# Altium schematic sheet Precharge.SchDoc
size A4; SheetNumber: 5; SheetTotal: 6
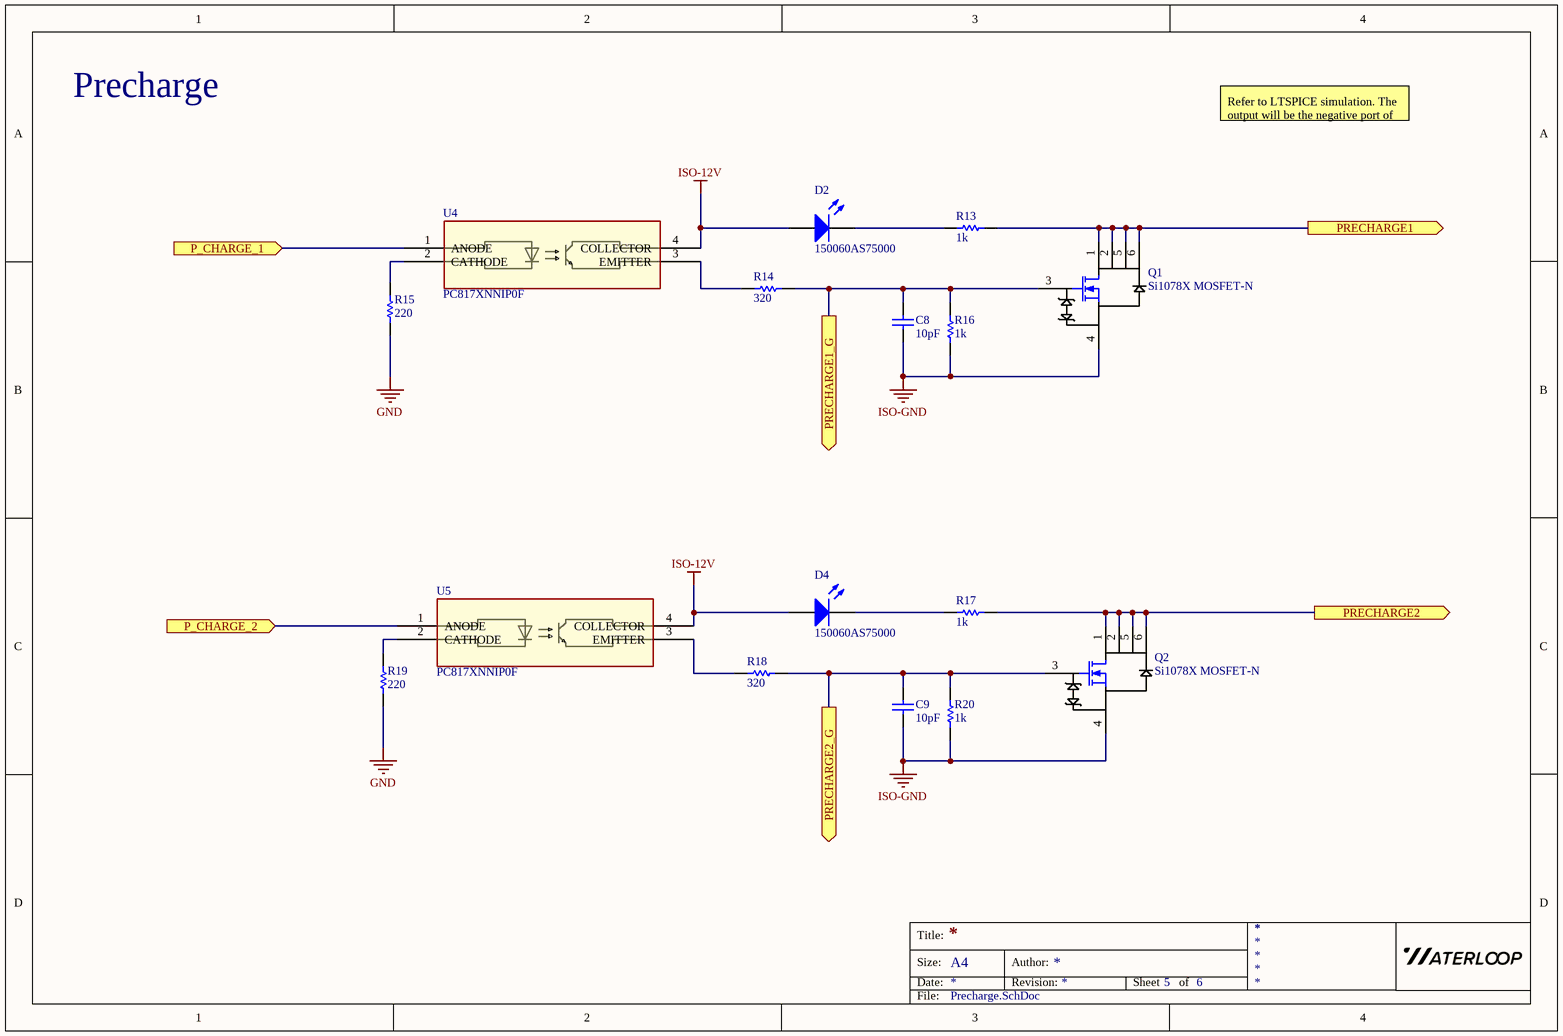
[diagram p0: Precharge.SchDoc]

## Parts
C8  value 10pF  [0603 - Capacitor]  (hidden comment: Capacitor - Nonpolarized)
C9  value 10pF  [0603 - Capacitor]  (hidden comment: Capacitor - Nonpolarized)
D2  150060AS75000  [0603 - Resistor]
D4  150060AS75000  [0603 - Resistor]
Q1  Si1078X MOSFET-N  [Si1078X NMOS 30V]
Q2  Si1078X MOSFET-N  [Si1078X NMOS 30V]
R13  value 1k  [0603 - Resistor]  (hidden comment: Resistor)
R14  value 320  [0603 - Resistor]  (hidden comment: Resistor)
R15  value 220  [0603 - Resistor]  (hidden comment: Resistor)
R16  value 1k  [0603 - Resistor]  (hidden comment: Resistor)
R17  value 1k  [0603 - Resistor]  (hidden comment: Resistor)
R18  value 320  [0603 - Resistor]  (hidden comment: Resistor)
R19  value 220  [0603 - Resistor]  (hidden comment: Resistor)
R20  value 1k  [0603 - Resistor]  (hidden comment: Resistor)
U4  PC817XNNIP0F  [PC817XNNIP0F_SHP]
U5  PC817XNNIP0F  [PC817XNNIP0F_SHP]

## Ports
P_CHARGE_1 (in), P_CHARGE_2 (in), PRECHARGE1 (out), PRECHARGE1_G (out), PRECHARGE2 (out), PRECHARGE2_G (out)

## Nets
GND: R15.1 R19.1
ISO-12V: D2.1(A) D4.1(A) U4.4(COLLECTOR) U5.4(COLLECTOR)
ISO-GND: C8.1 C9.1 Q1.4 Q2.4 R16.1 R20.1
P_CHARGE_1: U4.1(ANODE) ; port P_CHARGE_1
P_CHARGE_2: U5.1(ANODE) ; port P_CHARGE_2
PRECHARGE1: Q1.1(G) Q1.2(D) Q1.5 Q1.6 R13.1 ; port PRECHARGE1
PRECHARGE1_G: C8.2 Q1.3 R14.2 R16.2 ; port PRECHARGE1_G
PRECHARGE2: Q2.1(G) Q2.2(D) Q2.5 Q2.6 R17.1 ; port PRECHARGE2
PRECHARGE2_G: C9.2 Q2.3 R18.2 R20.2 ; port PRECHARGE2_G
NetD2_2: D2.2(K) R13.2
NetD4_2: D4.2(K) R17.2
NetR14_1: R14.1 U4.3(EMITTER)
NetR15_2: R15.2 U4.2(CATHODE)
NetR18_1: R18.1 U5.3(EMITTER)
NetR19_2: R19.2 U5.2(CATHODE)

## Notes on the sheet
- Precharge
- Refer to LTSPICE simulation. The output will be the negative port of the precharge/contactor circuit
- Title:
- Size:
- Date:
- A4
- Author:
- Revision:
- Sheet
- of
- File:

## Library data of the parts
C8 C9 = Capacitor - Nonpolarized: Nonpolarized Capacitor; Supplier Part Number: *; Supplier: *; Manufacturer: *; Rating: *; Manufacturer Part Number: *
D2 D4 = LED: Amber 605nm LED Indication - Discrete 2V 0603 (1608 Metric); Manufacturer: Würth Elektronik; Value: *; Manufacturer Part Number: 150060AS75000; Supplier Part Number: 732-150060AS75000CT-ND; Rating: *; Supplier: Digi-Key
Q1 Q2 = Si1078X MOSFET-N: N-Channel 30 V (D-S) MOSFET; Manufacturer Name: Vishay Semiconductors; Manufacturer Part Number: SI1078X-T1-GE3; Supplier Name: Mouser; Supplier Part Number: 78-SI1078X-T1-GE3; ComponentLink1Description: Mouser; ComponentLink1URL: https://www.mouser.ca/ProductDetail/Vishay-Semiconductors/SI1078X-T1-GE3?qs=EBLjwc9jJJulNr1%252B%2FwN60A%3D%3D
U4 U5 = PC817XNNIP0F: Transistor Output Optocouplers Photocoupler; Manufacturer Name: Sharp; Manufacturer Part Number: PC817XNNIP0F; Type: DEV; Supplier: Mouser; Supplier Part Number: 852-PC817X3NIP1B
R13-R20 = Resistor: Rating: *; Manufacturer Part Number: *; Manufacturer: *; Supplier Part Number: *; Supplier: *